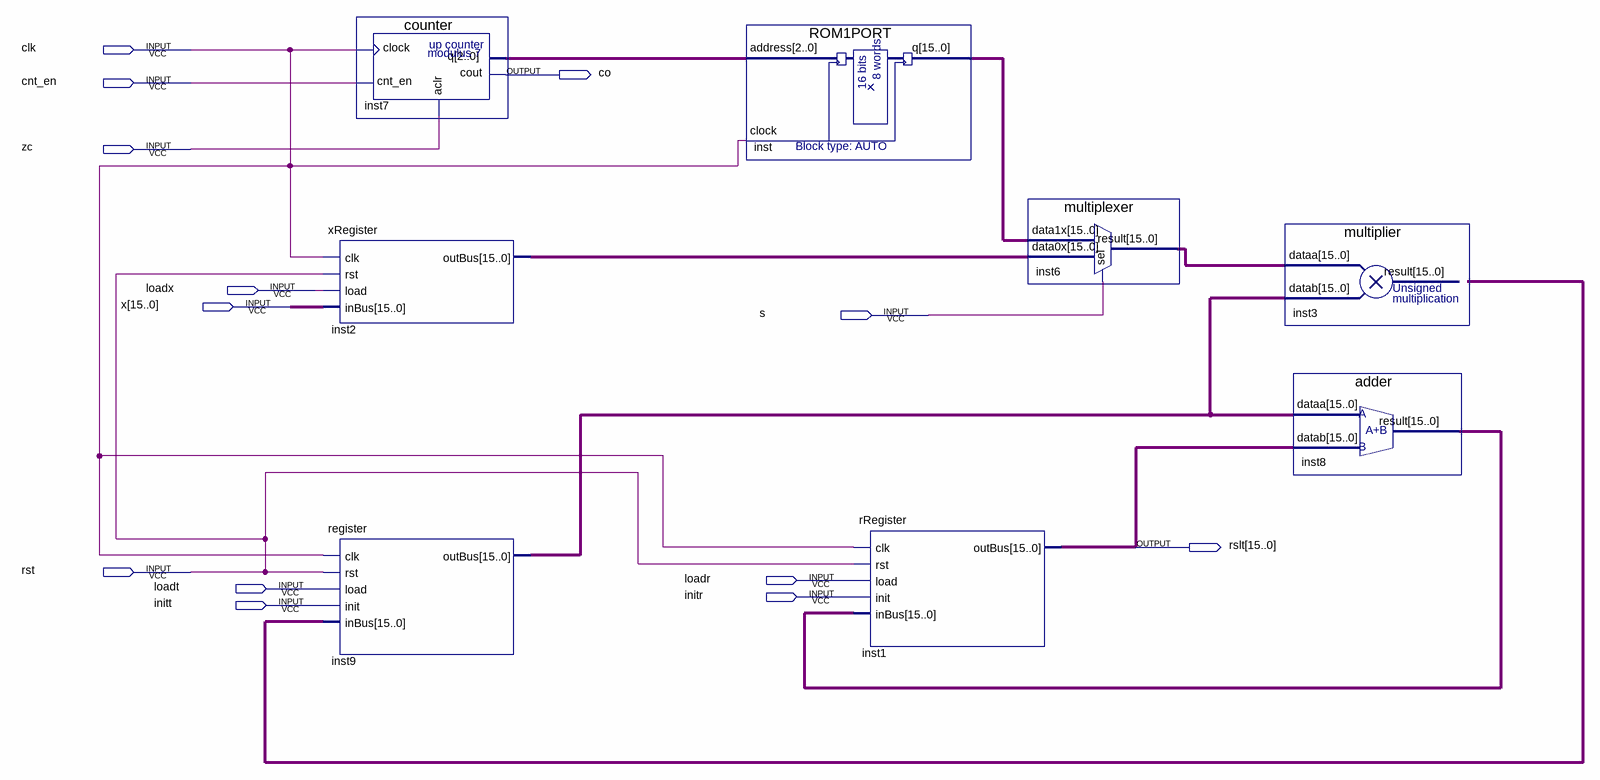
[diagram p0: schematic sheet]
// Quartus schematic tanx.bdf as structural Verilog: 8 symbols, 13 pins
module tanx (
  input  clk,
  input  cnt_en,
  input  zc,
  input  loadx,
  input  [15:0] x,
  input  s,
  input  rst,
  input  loadr,
  input  loadt,
  input  initr,
  input  initt,
  output co,
  output [15:0] rslt
);

  wire [2:0] inst7_q;
  wire [15:0] inst2_outbus, inst3_result, inst6_result, inst8_result, inst9_outbus, inst_q;

  xRegister inst2 (.clk(clk), .rst(rst), .load(loadx), .inBus(x), .outBus(inst2_outbus));
  register inst9 (.clk(clk), .rst(rst), .load(loadt), .init(initt), .inBus(inst3_result), .outBus(inst9_outbus));
  counter inst7 (.clock(clk), .cnt_en(cnt_en), .aclr(zc), .cout(co), .q(inst7_q));
  ROM1PORT inst (.address(inst7_q), .clock(clk), .q(inst_q));
  rRegister inst1 (.clk(clk), .rst(rst), .load(loadr), .init(initr), .inBus(inst8_result), .outBus(rslt));
  multiplexer inst6 (.data1x(inst_q), .data0x(inst2_outbus), .sel(s), .result(inst6_result));
  multiplier inst3 (.dataa(inst6_result), .datab(inst9_outbus), .result(inst3_result));
  adder inst8 (.dataa(inst9_outbus), .datab(rslt), .result(inst8_result));
endmodule
